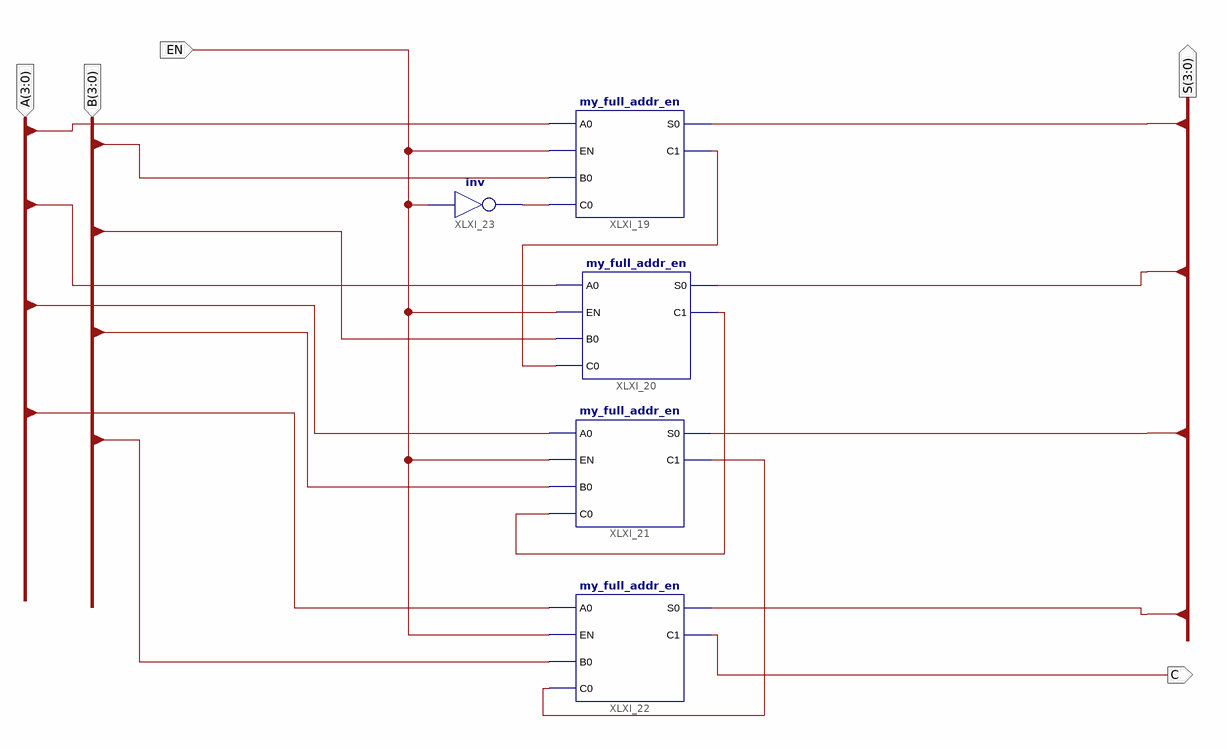
[diagram p0: schematic sheet 1]
// Xilinx ISE schematic my_4bit_addr.sch (virtex6) as structural Verilog: 5 symbols, 5 ports
module my_4bit_addr (
  input  [3:0] B,
  input  [3:0] A,
  input  EN,
  output [3:0] S,
  output C
);

  wire XLXN_31, XLXN_46, XLXN_64, XLXN_71, XLXN_72;

  my_full_addr_en XLXI_19 (.A0(A[0]), .B0(B[0]), .C0(XLXN_72), .C1(XLXN_46), .EN(EN), .S0(S[0]));
  my_full_addr_en XLXI_20 (.A0(A[1]), .B0(XLXN_71), .C0(XLXN_46), .C1(XLXN_31), .EN(EN), .S0(S[1]));
  my_full_addr_en XLXI_21 (.A0(A[2]), .B0(B[2]), .C0(XLXN_31), .C1(XLXN_64), .EN(EN), .S0(S[2]));
  my_full_addr_en XLXI_22 (.A0(A[3]), .B0(B[3]), .C0(XLXN_64), .C1(C), .EN(EN), .S0(S[3]));
  not XLXI_23 (XLXN_72, EN);
endmodule
